# EAGLE design rj45-breakout-9.3 (EAGLE 9.6.1)
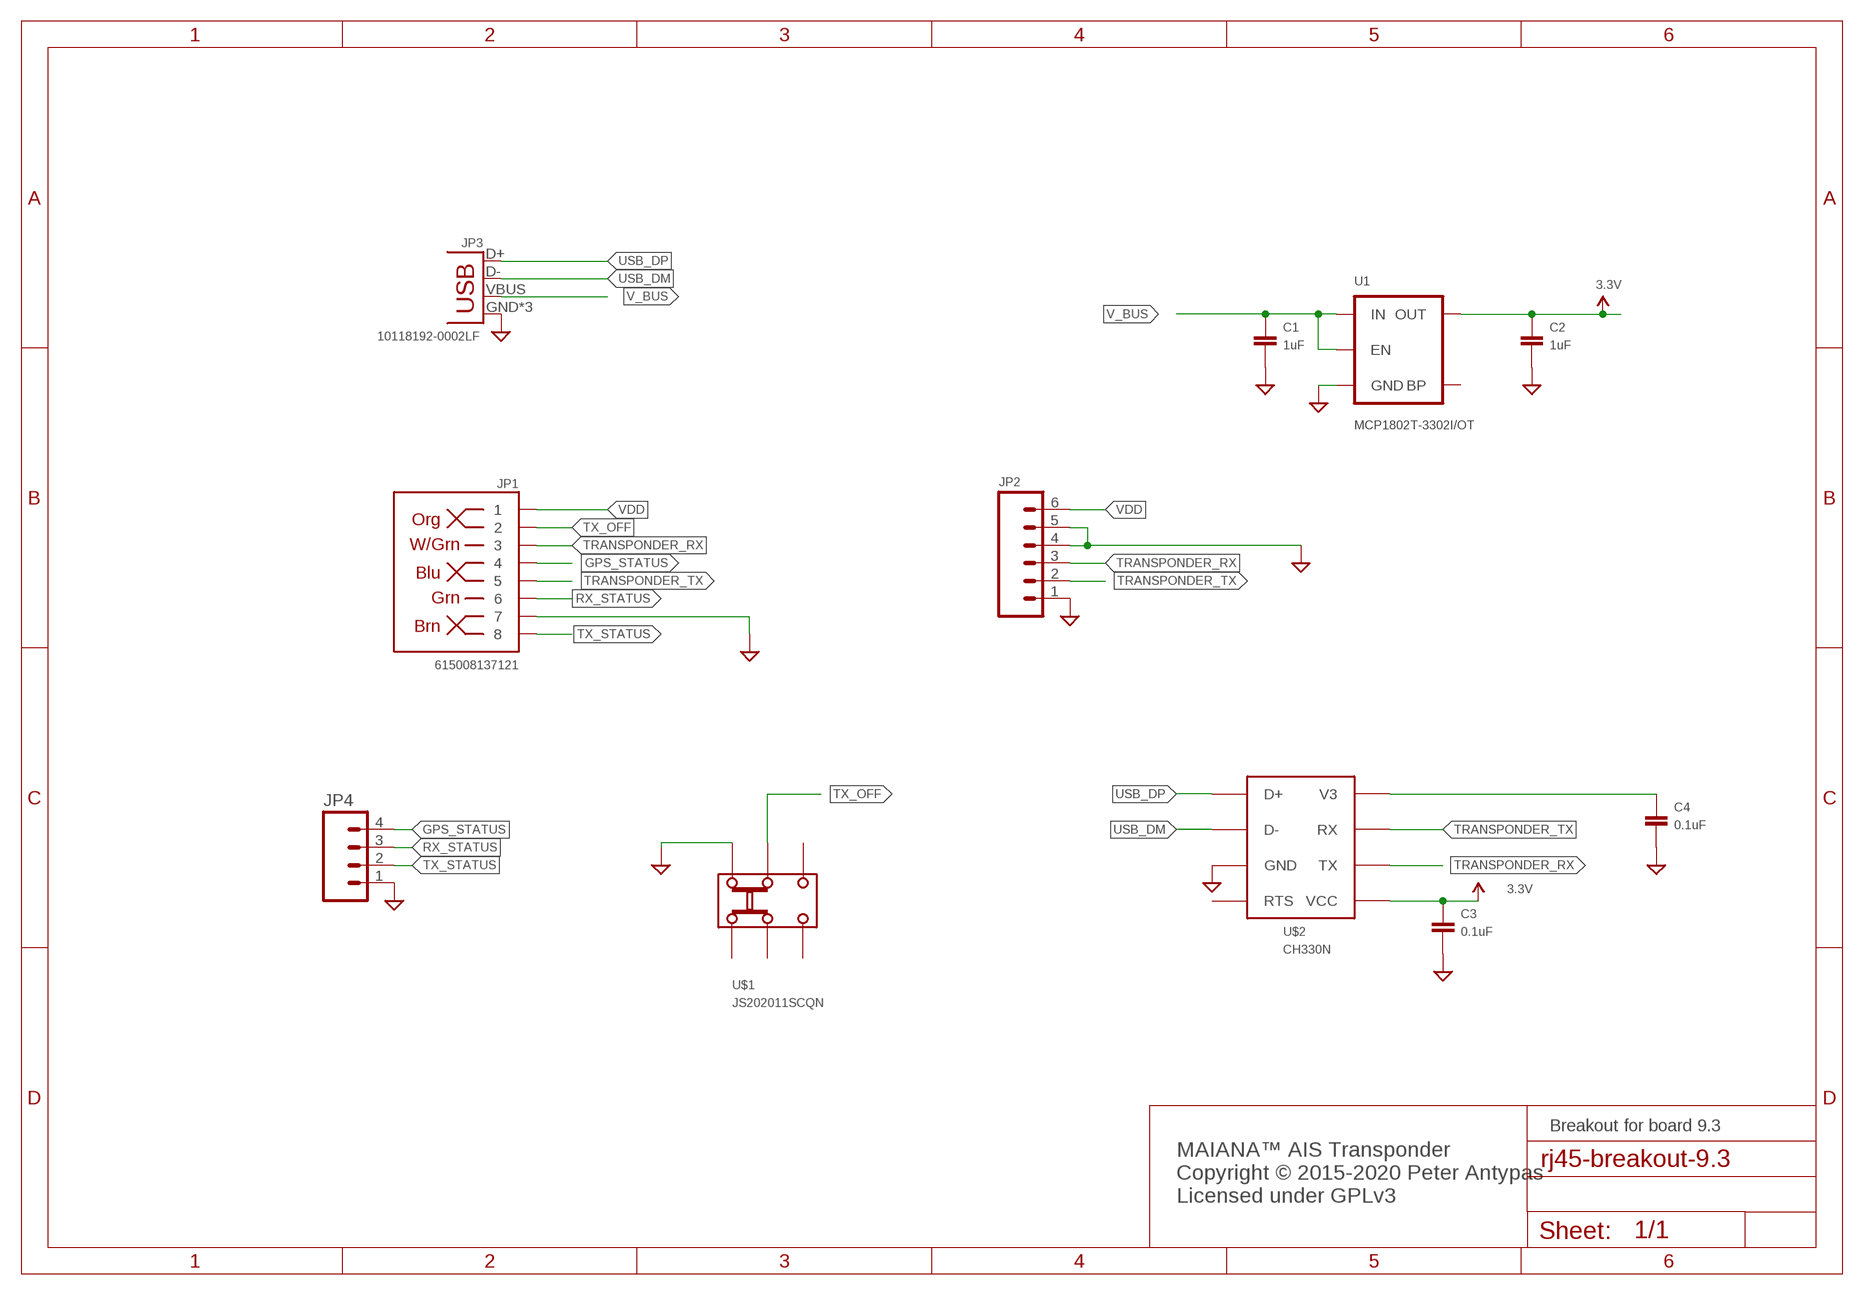
[diagram p0: schematic, sheet 1]

## Parts
C1  1uF  CAPACITOR0603  [0603]
C2  1uF  CAPACITOR0603  [0603]
C3  0.1uF  CAPACITOR0603  [0603]
C4  0.1uF  CAPACITOR0603  [0603]
JP1  615008137121  RJ45-8PTH  [RJ45-8]
JP2  M06SILK_FEMALE_PTH  [1X06]
JP3  10118192-0002LF  USB-MICROB  [USB-MICROB]
JP4  M04PTH  [1X04]
U1  MCP1802T-3302I/OT  V_REG_LDOSMD  [SOT23-5]
U$1  JS202011SCQN  [DPDT-SMD]
U$2  CH330N  [SOIC-8]

## Nets
3.3V: C2.P$1 C3.P$1 U1.5(OUT) U$2.5(VCC)
GND: C1.P$2 C2.P$2 C3.P$2 C4.P$2 JP1.7 JP2.1 JP2.4 JP2.5 JP3.GND JP3.MT1(GND) JP3.MT2(GND) JP4.1 U1.2(GND) U$1.P$6 U$2.3(GND)
GPS_STATUS: JP1.4 JP4.4
N$1: C4.P$1 U$2.8(V3)
RX_STATUS: JP1.6 JP4.3
TRANSPONDER_RX: JP1.3 JP2.3 U$2.6(TX)
TRANSPONDER_TX: JP1.5 JP2.2 U$2.7(RX)
TX_OFF: JP1.2 U$1.P$5
TX_STATUS: JP1.8 JP4.2
USB_DM: JP3.D- U$2.2(D-)
USB_DP: JP3.D+ U$2.1(D+)
V_BUS: C1.P$1 JP3.VBUS U1.1(IN) U1.3(EN)
VDD: JP1.1 JP2.6
Unconnected: U1.4(BP) U$1.P$1 U$1.P$2 U$1.P$3 U$1.P$4 U$2.4(RTS)

## Notes on the sheet
- Breakout for board 9.3
- MAIANA™ AIS Transponder
  Copyright © 2015-2020 Peter Antypas
  Licensed under GPLv3

## Library data of the parts
C1-C4 = MyPassives:CAPACITOR: Standard SMD capacitor
JP1 = SparkFun-Connectors:RJ45-8: RJ45 Jack Simple RJ45, 8-pin connection - connector for common Cat5, Cat5e, and Cat6 Ethernet cables. Footprint not yet proven in production. Connector sku is PRT-00643; Breakout PCB sku is BOB-00716.; PROD_ID: CONN-08506; VALUE: RJ45
JP2 = SparkFun-Connectors:M06: Header 6 Standard 6-pin 0.1" header. Use with straight break away headers (SKU : PRT-00116), right angle break away headers (PRT-00553), swiss pins (PRT-00743), machine pins (PRT-00117), and female headers (PRT-00115). Molex polarized connector foot print use with SKU : PRT-08094 with associated crimp pins and housings. NOTES ON THE VARIANTS LOCK and LOCK_LONGPADS... This footprint was designed to help hold the alignment of a through-hole component (i.e. 6-pin header) while soldering it into place. You may notice that each hole has been shifted either up or down by 0.005 of an inch from it's more standard position (which is a perfectly straight line). This slight alteration caused the pins (the squares in the middle) to touch the edges of the holes. Because they are alternating, it causes a "brace" to hold the component in place. 0.005 has proven to be the perfect amount of "off-center" position when using our standard breakaway headers. Although looks a little odd when you look at the bare footprint, once you have a header in there, the alteration is very hard to notice. Also,if you push a header all the way into place, it is covered up entirely on the bottom side. This idea of altering the position of holes to aid alignment will be further integrated into the Sparkfun Library for other footprints. It can help hold any component with 3 or more connection pins.; PROD_ID: CONN-08437
JP3 = SparkFun-Connectors:USB: USB Connectors USB-B-PTH is fully proven SKU : PRT-00139/CONN-08278 USB-miniB is fully proven SKU : PRT-00587 USB-A-PCB is untested. USB-A-H is throughly reviewed, but untested. Spark Fun Electronics SKU : PRT-00437 USB-B-SMT is throughly reviewed, but untested. Needs silkscreen touching up. USB-A-S has not been used/tested USB-MB-H has not been used/tested USB-MICROB has been used. CONN-09505; PROD_ID: CONN-09505
JP4 = SparkFun-Connectors:M04: Header 4 Standard 4-pin 0.1" header. Use with straight break away headers (SKU : PRT-00116), right angle break away headers (PRT-00553), swiss pins (PRT-00743), machine pins (PRT-00117), and female headers (PRT-00115). Molex polarized connector foot print use with SKU : PRT-08231 with associated crimp pins and housings. 1MM SMD Version SKU: PRT-10208
U1 = SparkFun-PowerIC:V_REG_LDO: Voltage Regulator LDO Standard 150mA LDO voltage regulator in SOT-23 layout. Micrel part MIC5205. BP (by-pass) pin is used to lower output noise with 470pF cap.
U$1 = slide-switches:JS202011SCQN: DPDT Slide Switch, 300mA 6V
U$2 = JiangsuQinHeng:CH330N: USB to UART bridge

## Board
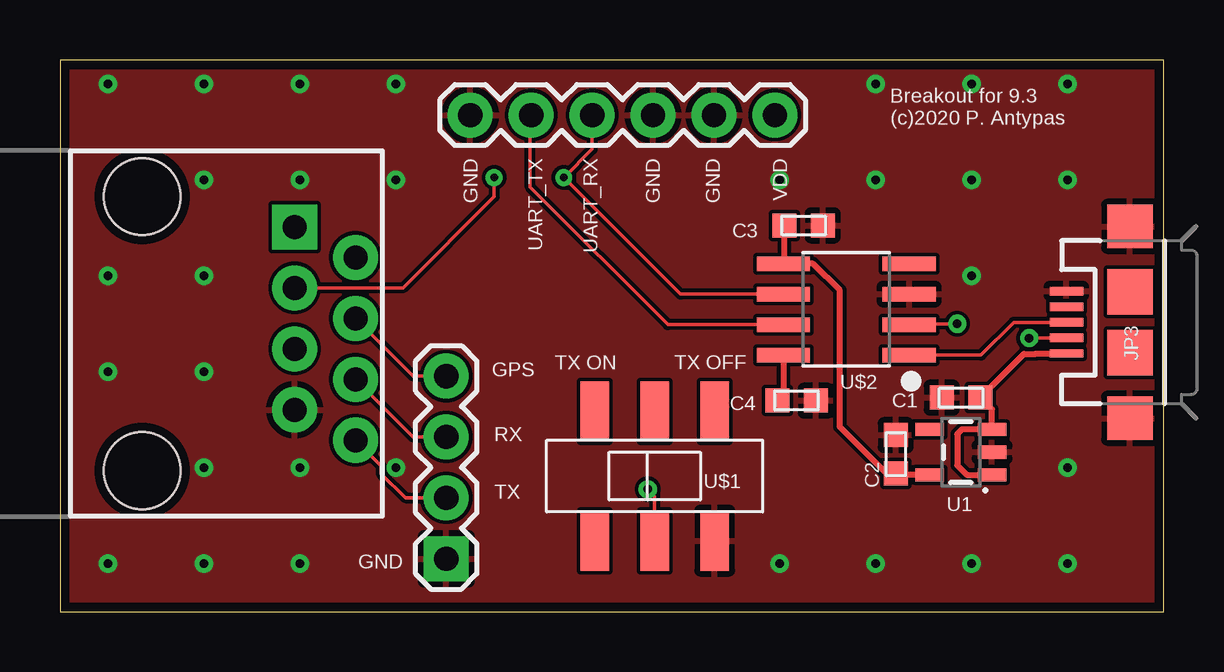
[diagram p1: board, top side]
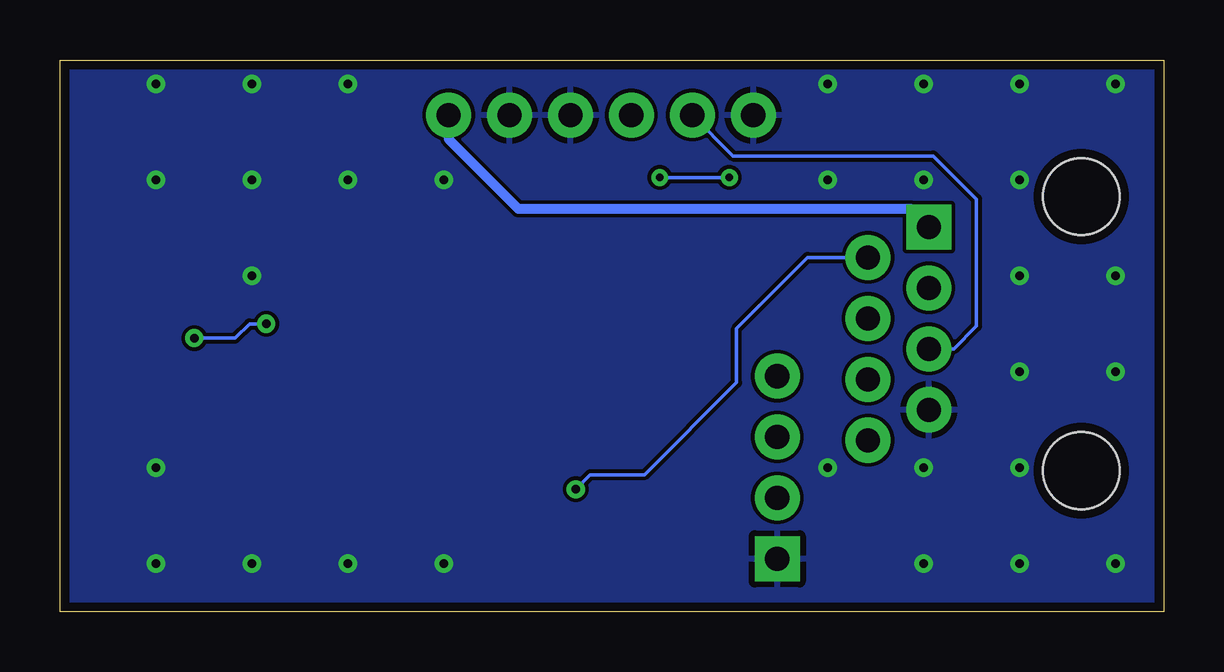
[diagram p2: board, bottom side, seen from below]

Size 46 x 23 mm. Coordinates in mm from the lower left corner, seen from the top.
Outline: 0,0 46,0 46,23 0,23 0,0
Copper layers (1*16): Top 0.035mm / dielectric 1.5mm / Bottom 0.035mm
Design rules "default *": minimum track width 6mil, minimum drill 0.3mm, track to track 6mil, track to pad 6mil, pad to pad 6mil, via to via 6mil, smd to smd 0mil, copper to edge 15mil, drill to drill 6mil, minimum pad ring 10mil, minimum via ring 8mil, stop-mask expansion 0mil, vias tented up to drill 20mil, thermal gap 10mil

### Footprints (pad centres in the part's own frame; a part is rotated, then mirrored left to right if it is on the bottom)
0603 = smd 1 x 1: P$1 -0.8,0; P$2 0.8,0
RJ45-8 = drill 1 pad 1.88 square: 1 -4.445,6.35 | drill 1 pad 1.88: 2 -3.175,8.89; 3 -1.905,6.35; 4 -0.635,8.89; 5 0.635,6.35; 6 1.905,8.89; 7 3.175,6.35; 8 4.445,8.89 | hole 3.2: -5.715,0; 5.715,0
1X06 = drill 1.016 pad 1.88: 1 0,0; 2 2.54,0; 3 5.08,0; 4 7.62,0; 5 10.16,0; 6 12.7,0
USB-MICROB = smd 0.35 x 1.4: D+ 0,2.65; D- -0.65,2.65; GND 1.3,2.65; ID 0.65,2.65; VBUS -1.3,2.65 | smd 1.8 x 1.9: MT1 -4,0; MT2 4,0 | smd 1.9 x 1.9: P$1 -1.27,0; P$2 1.27,0
1X04 = drill 1.016 pad 1.88 square: 1 0,0 | drill 1.016 pad 1.88: 2 2.54,0; 3 5.08,0; 4 7.62,0
SOT23-5 = smd 0.55 x 1.2: 1 -0.95,-1.3; 2 0,-1.3; 3 0.95,-1.3; 4 0.95,1.3; 5 -0.95,1.3
DPDT-SMD = smd 1.2 x 2.5: P$1 -2.5,-2.7; P$2 0,-2.7; P$3 2.5,-2.7; P$4 2.5,2.7; P$5 0,2.7; P$6 -2.5,2.7
SOIC-8 = smd 2.21 x 0.61: 1 -2.616,1.905; 2 -2.616,0.635; 3 -2.616,-0.635; 4 -2.616,-1.905; 5 2.616,-1.905; 6 2.616,-0.635; 7 2.616,0.635; 8 2.616,1.905

### Placement (x,y rotation side)
C1  37.56,8.92 180 top
C2  34.84,6.56 90 top
C3  31,16.1 0 top
C4  30.7,8.8 0 top
JP1  3.43,11.59 270 top
JP2  17.1,20.7 0 top
JP3  44.6,12.06 90 top
JP4  16.1,2.2 90 top
U1  37.55,6.65 90 top
U$1  24.79,5.65 180 top
U$2  32.78,12.6 180 top

### Tracks (layer width: path | path; a pad name or v marks a point on that pad's centre or on a via)
3.3V
  Top 0.254: U1.5 34.9,5.7 C2.P$1 34.44,5.76 32.5,7.7 32.5,13.4 31.39,14.51 U$2.5 30.2,14.54 C3.P$1
GND  (via drill 0.35)
  other vias: 2,2 6,2 10,2 14,6 10,6 6,6 30,2 34,2 38,2 42,2 42,6 42,22 42,18 38,18 38,22 34,22 34,18 30,18 38,14 2,22 6,22 10,22 14,22 14,18 10,18 6,18 6,14 6,10 2,14 2,10
  pour Top: -1,25 48,25 48,-1 -1,-1
  pour Bottom: -3,26 50,26 50,-2 -3,-2
GPS_STATUS
  Top 0.152: JP1.4 14.72,9.82 JP4.4
N$1
  Top 0.254: U$2.8 30.16,9.06 C4.P$1
RX_STATUS
  Top 0.152: JP1.6 14.72,7.28 JP4.3
TRANSPONDER_RX  (via drill 0.3)
  Top 0.152: JP2.3 22.18,19.28 v21,18.1 25.86,13.23 U$2.6 | v18.1,18.1 18.1,17.3 14.29,13.49 JP1.3
  Bottom 0.152: v21,18.1 v18.1,18.1
TRANSPONDER_TX
  Top 0.152: U$2.7 25.34,11.96 19.6,17.7 19.6,20.66 JP2.2
  Bottom 0.152: JP2.2 17.94,19 9.6,19 7.8,17.2 7.8,11.9 8.74,10.96 JP1.5
TX_OFF  (via drill 0.35)
  Top 0.152: v24.5,5.1 24.79,4.81 U$1.P$5
  Bottom 0.152: v24.5,5.1 23.9,5.7 21.64,5.7 17.8,9.54 17.8,11.8 14.84,14.77 JP1.2
TX_STATUS
  Top 0.152: JP1.8 13.39,6.07 13.39,5.75 14.4,4.74 JP4.2
USB_DM  (via drill 0.35)
  Top 0.152: JP3.D- v40.41,11.41 v40.4,11.4 | v37.4,12 35.43,12 U$2.2
  Bottom 0.152: v40.4,11.4 38.7,11.4 38.1,12 v37.4,12
USB_DP
  Top 0.152: JP3.D+ 39.76,12.06 38.4,10.7 U$2.1
V_BUS
  Top 0.254: U1.1 37.8,5.7 37.4,6.1 37.4,7.4 37.6,7.6 U1.3 38.85,8.43 C1.P$1 40.18,10.74 40.67,10.74 40.69,10.76 JP3.VBUS
VDD
  Bottom 0.406: JP2.6 29.8,19.7 26.9,16.8 10.54,16.8 JP1.1

### Text on the board
tNames: Breakout for 9.3 / (c)2020 P. Antypas | GND | UART_TX | UART_RX | GND | GND | VDD | TX ON | GPS | TX OFF | RX | TX | GND